# Altium project STAMPA KONACNO.PrjPcb
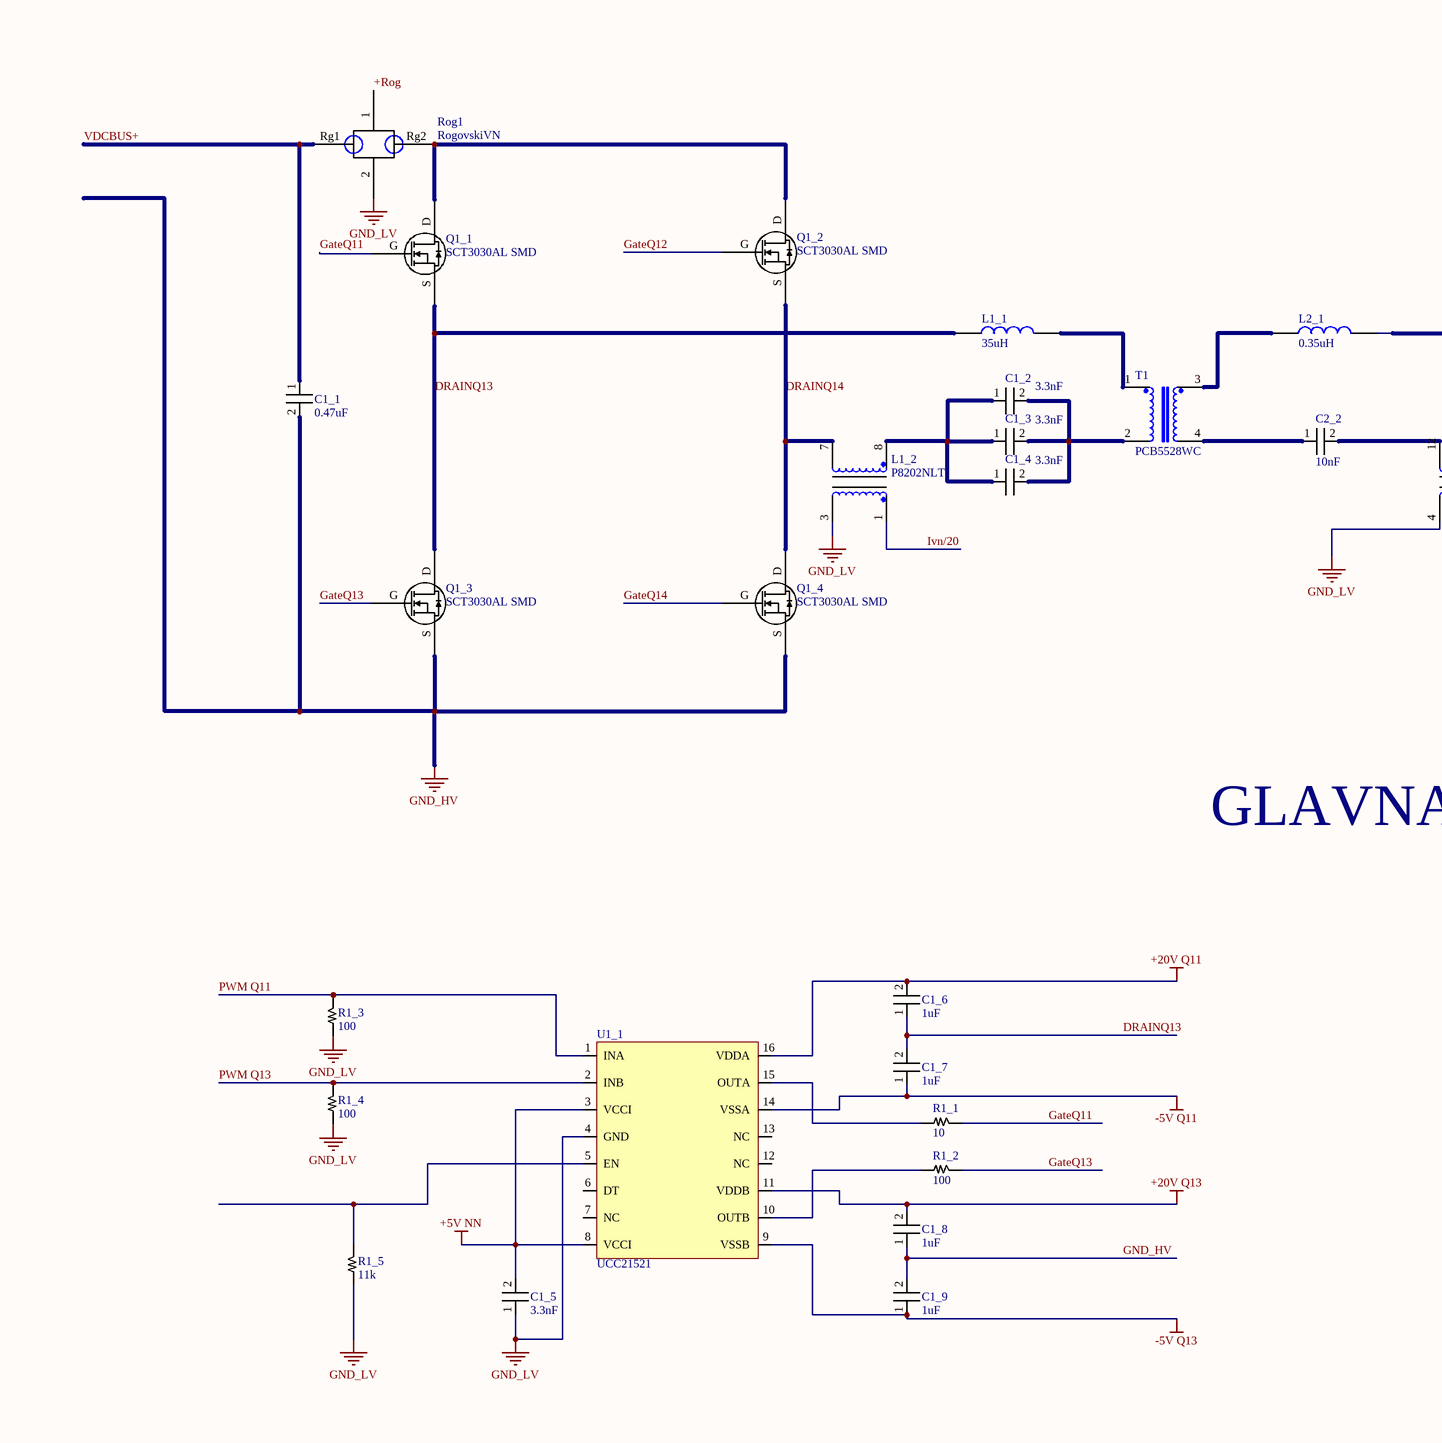
[diagram p0: SEMA KONACNO.SchDoc, row 1 of 4 left]
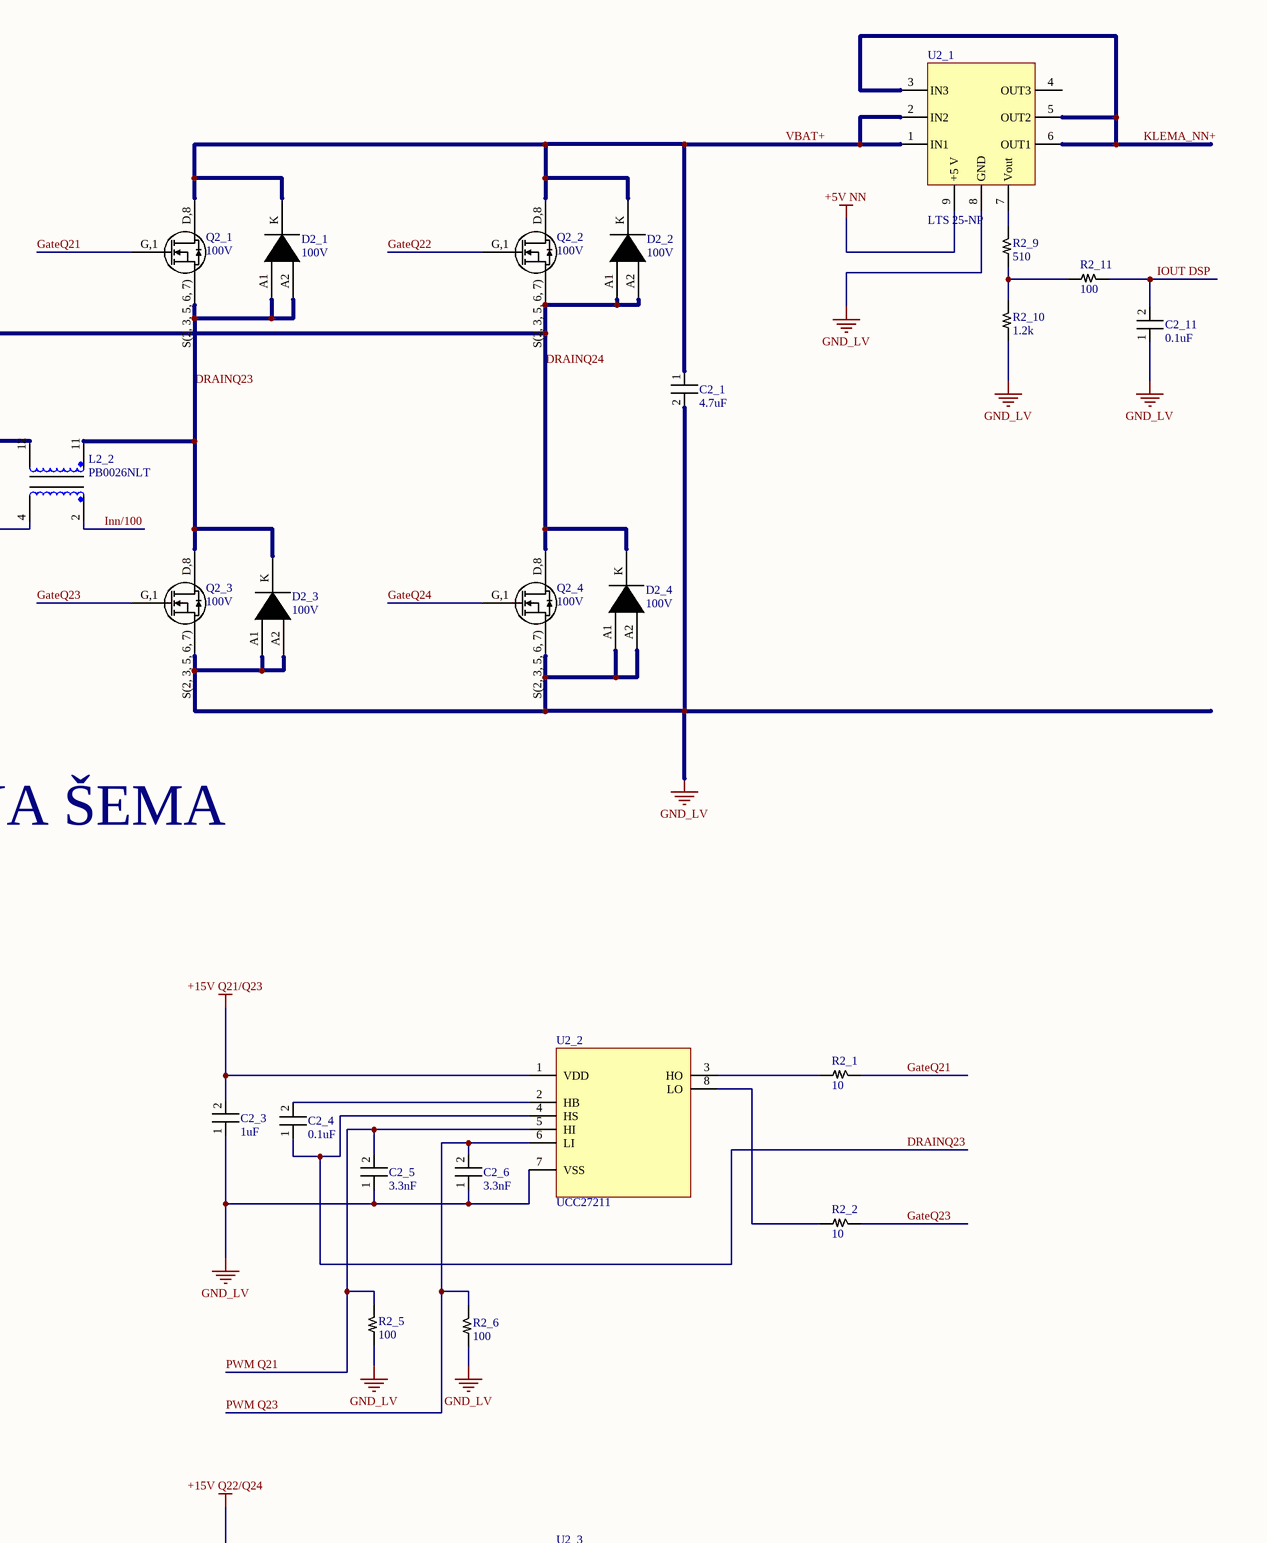
[diagram p1: SEMA KONACNO.SchDoc, row 1 of 4 right]
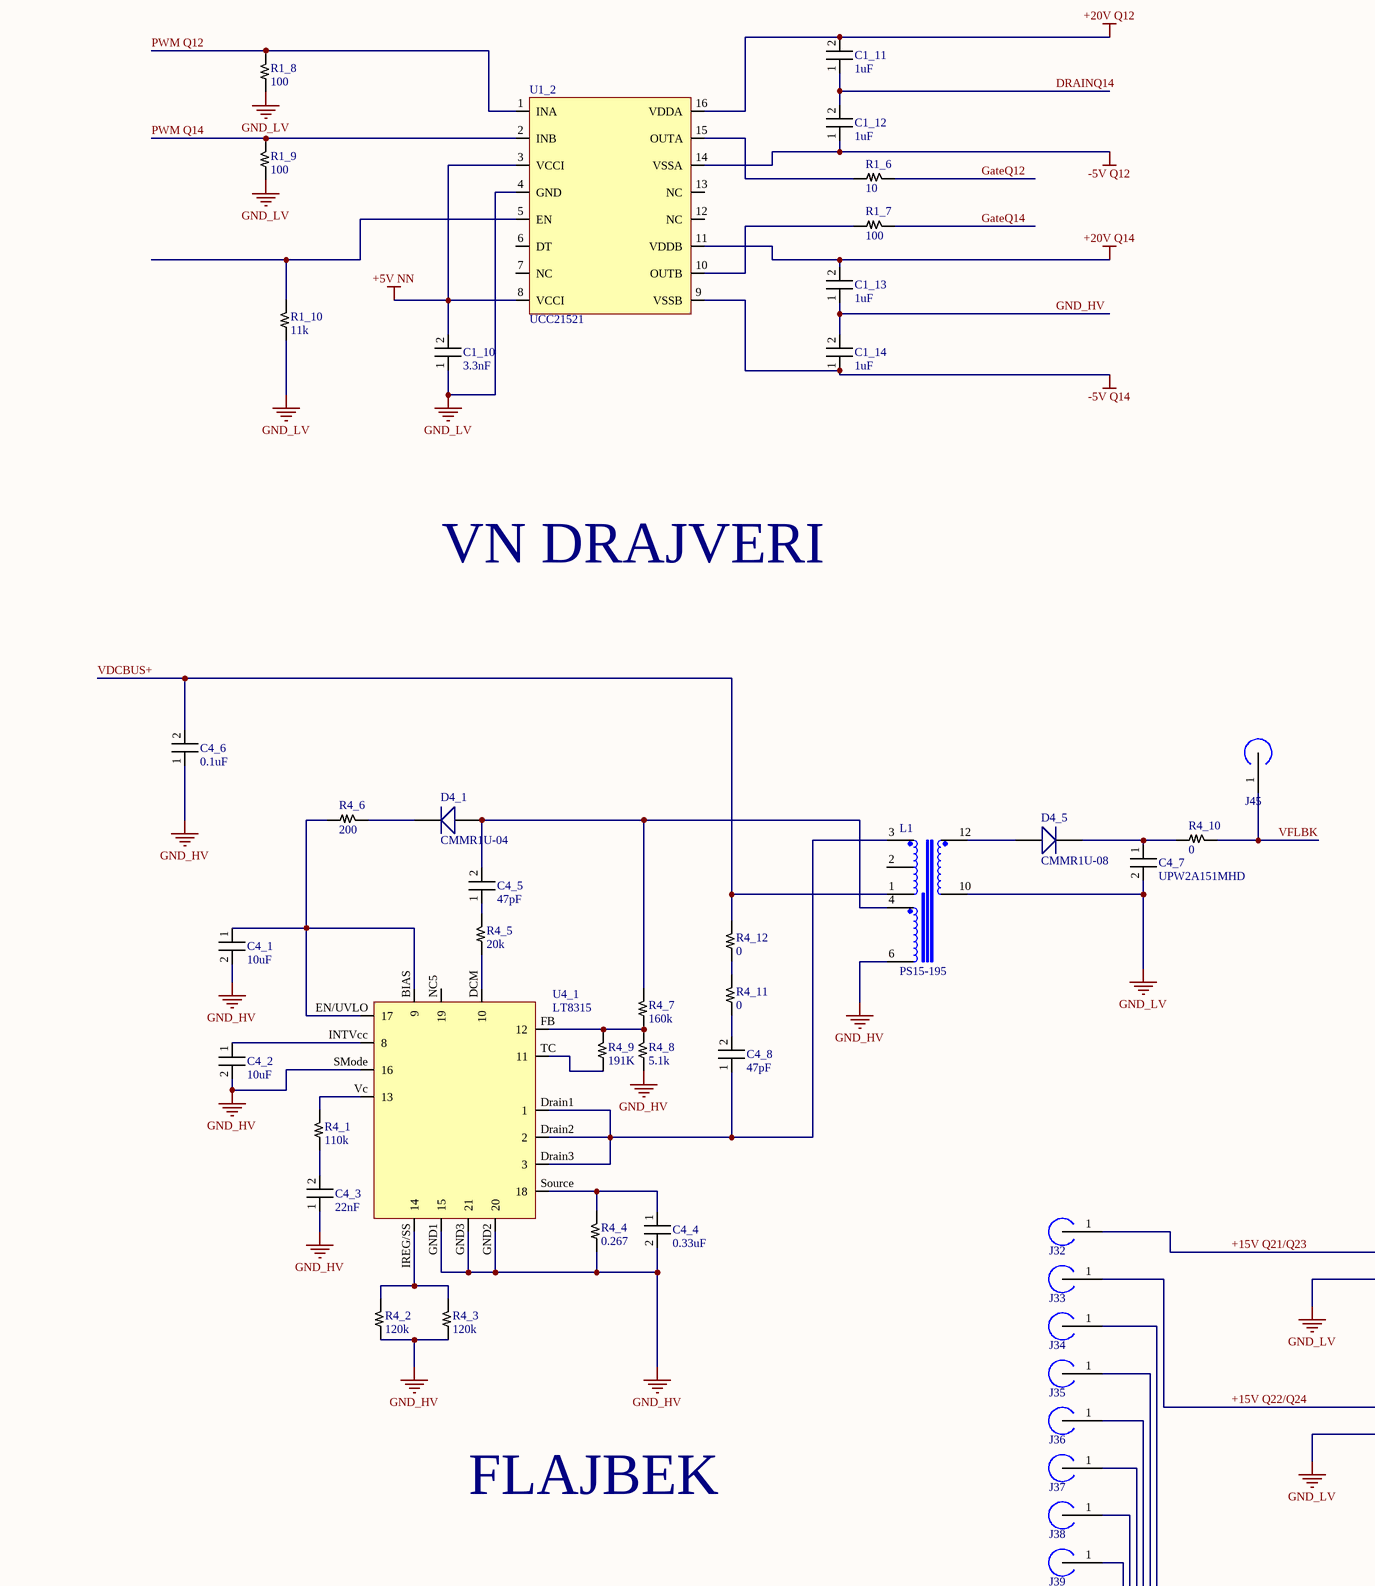
[diagram p2: SEMA KONACNO.SchDoc, row 2 of 4 left]
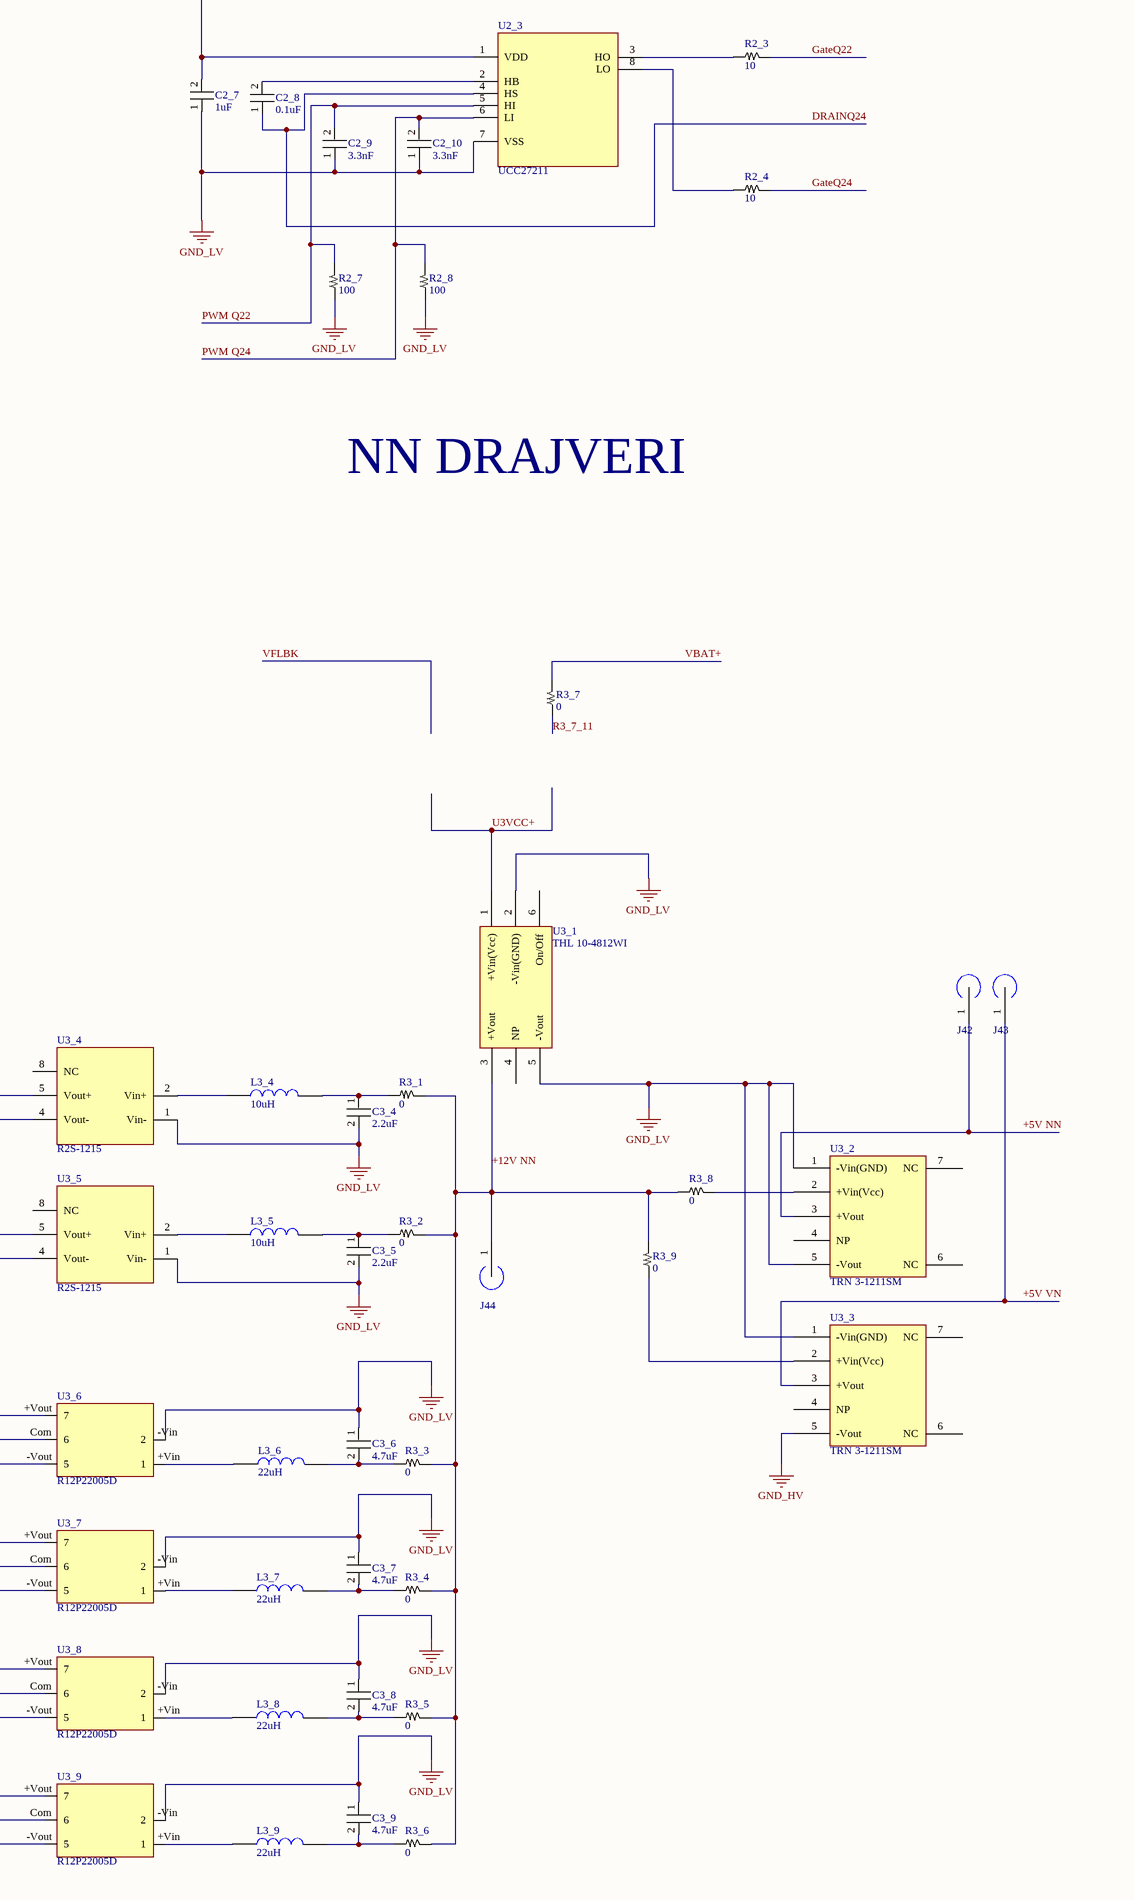
[diagram p3: SEMA KONACNO.SchDoc, row 2 of 4 right]
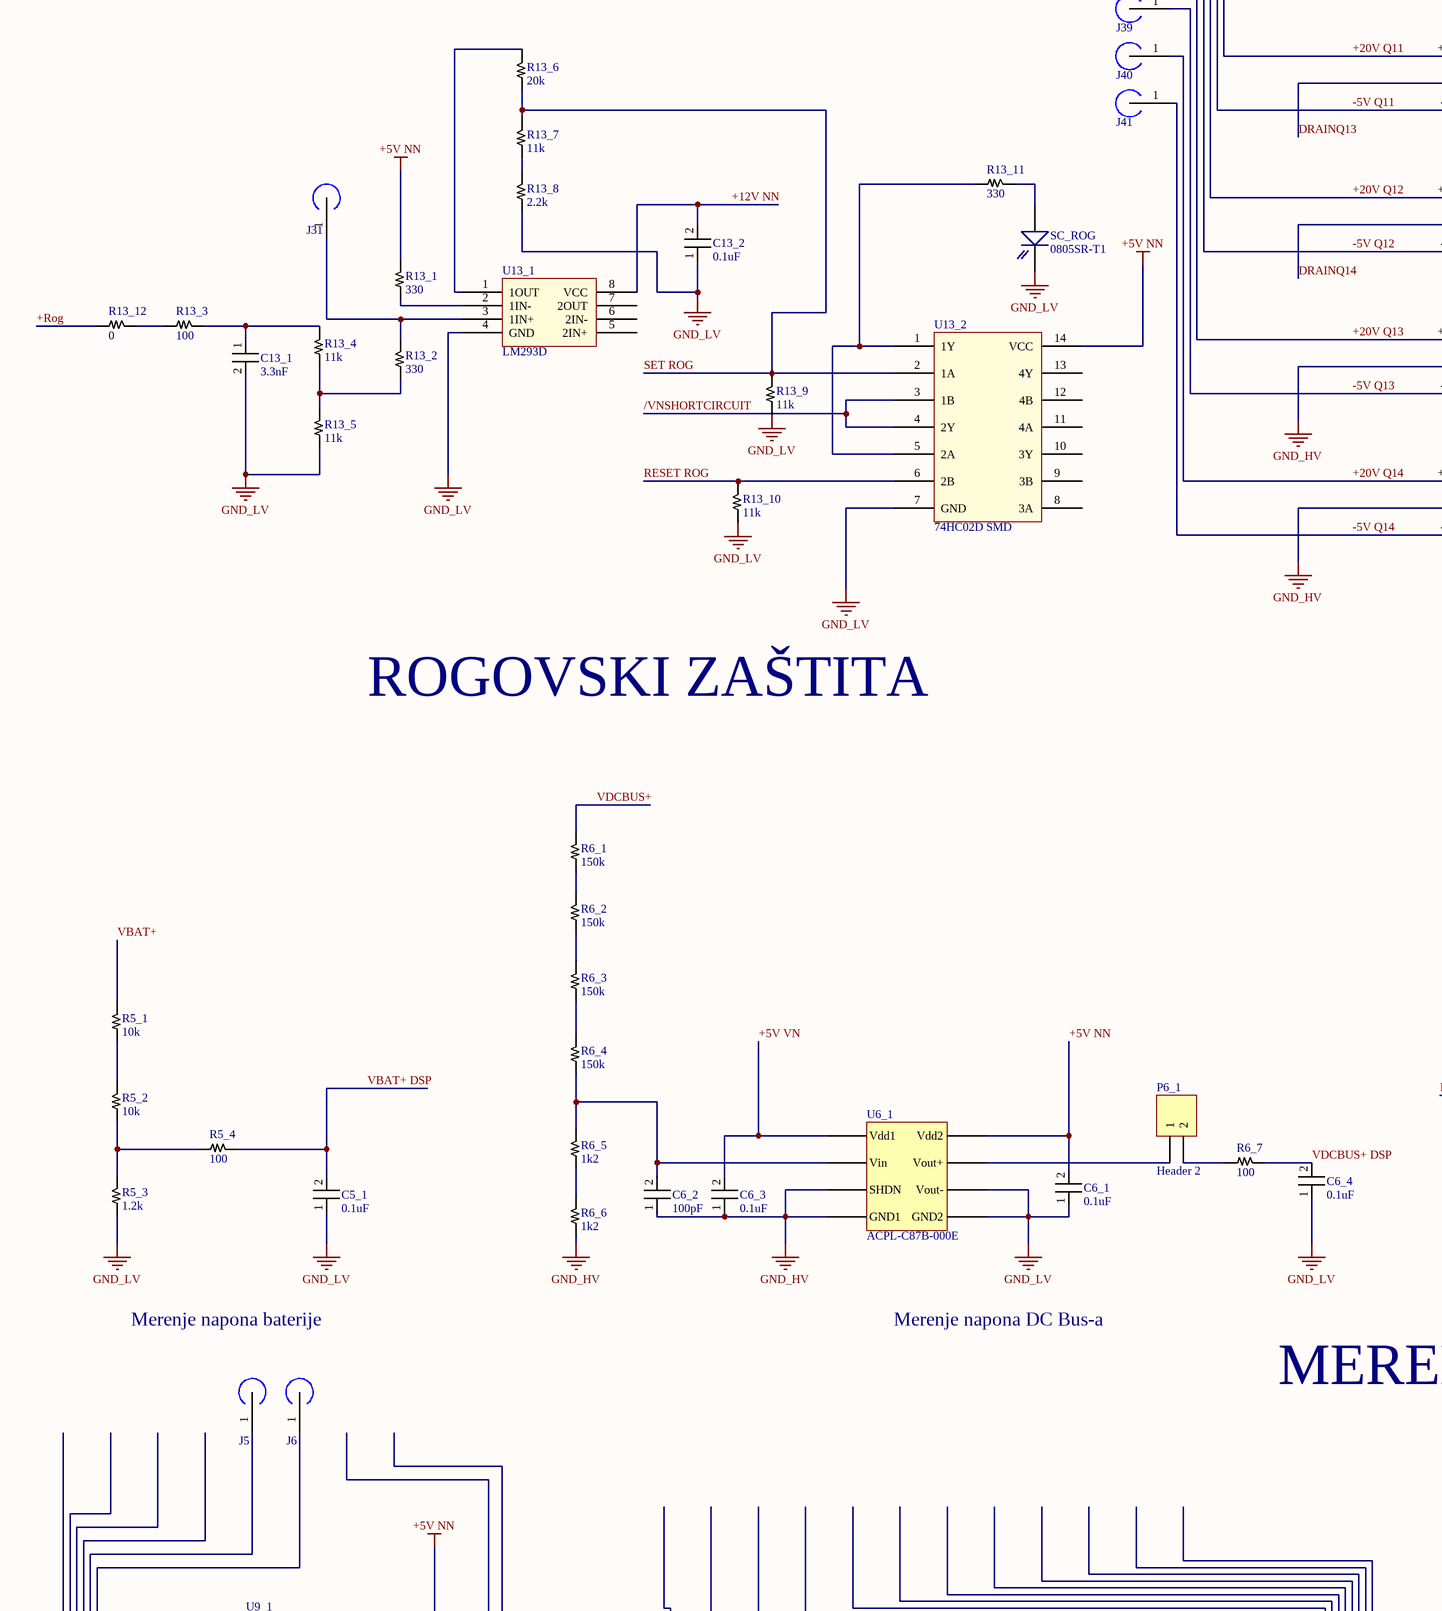
[diagram p4: SEMA KONACNO.SchDoc, row 3 of 4 left]
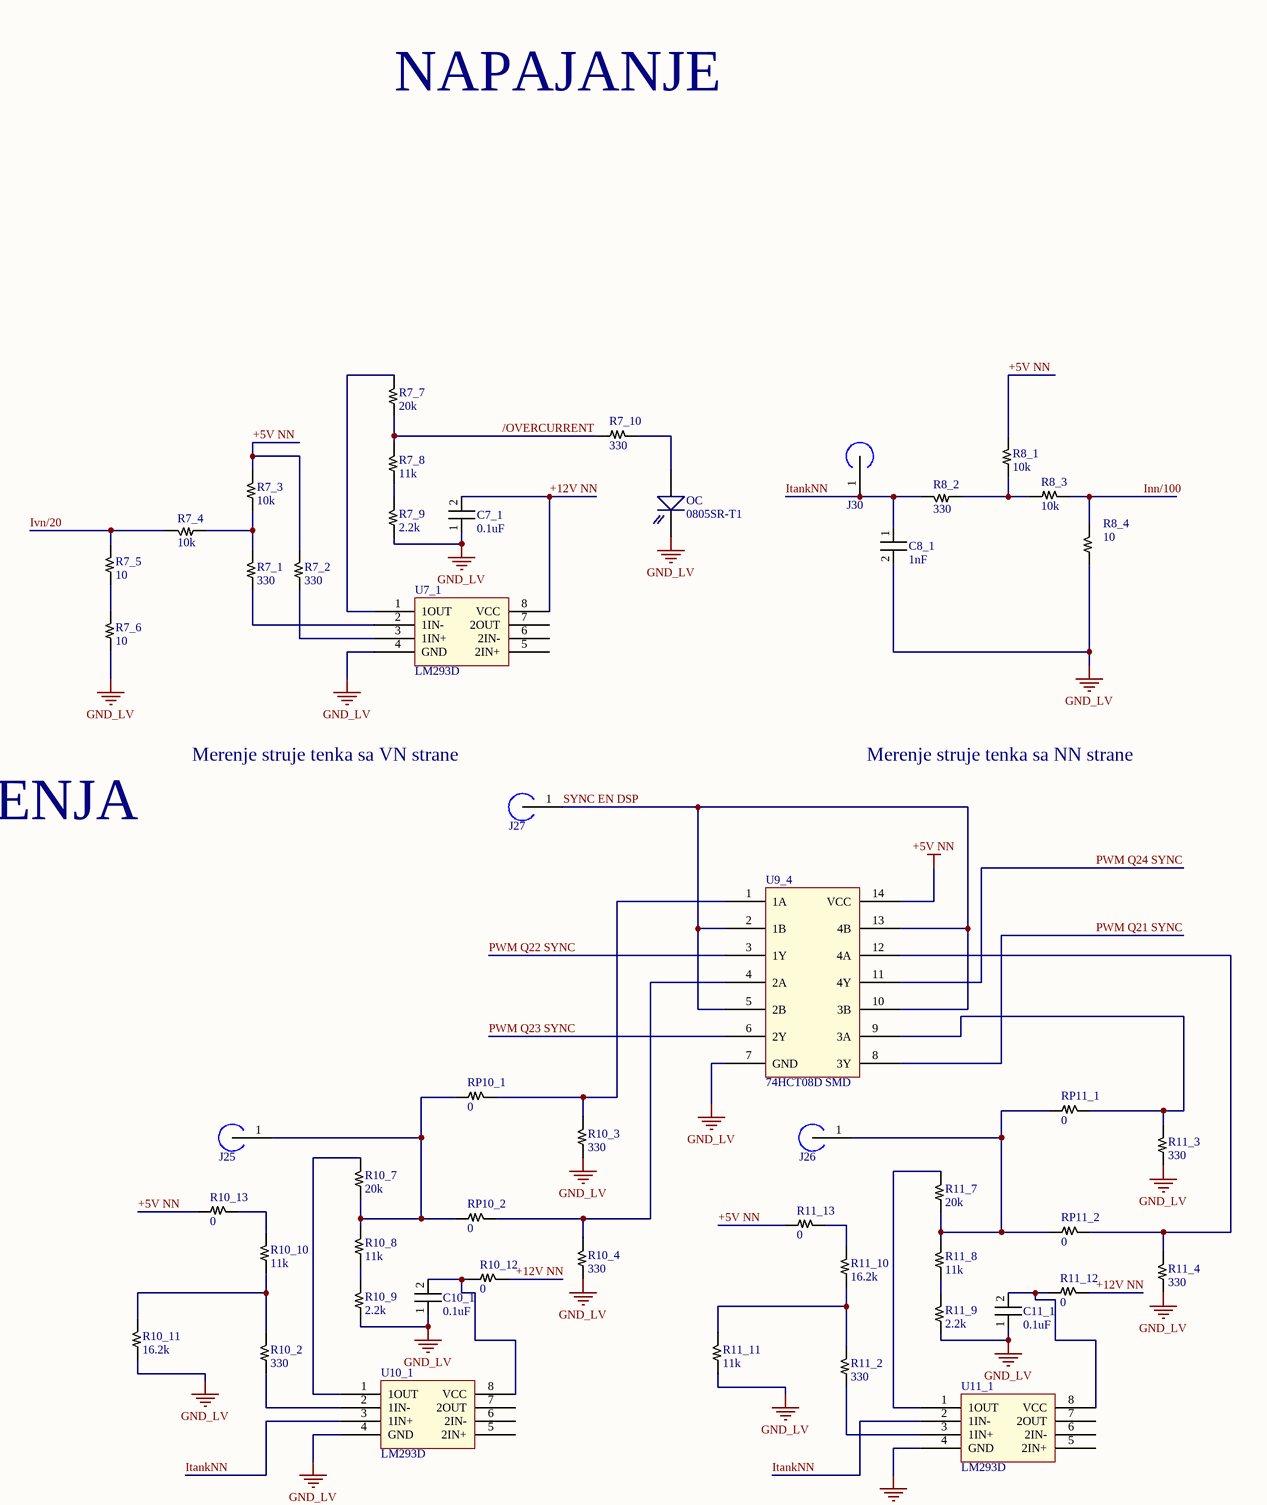
[diagram p5: SEMA KONACNO.SchDoc, row 3 of 4 right]
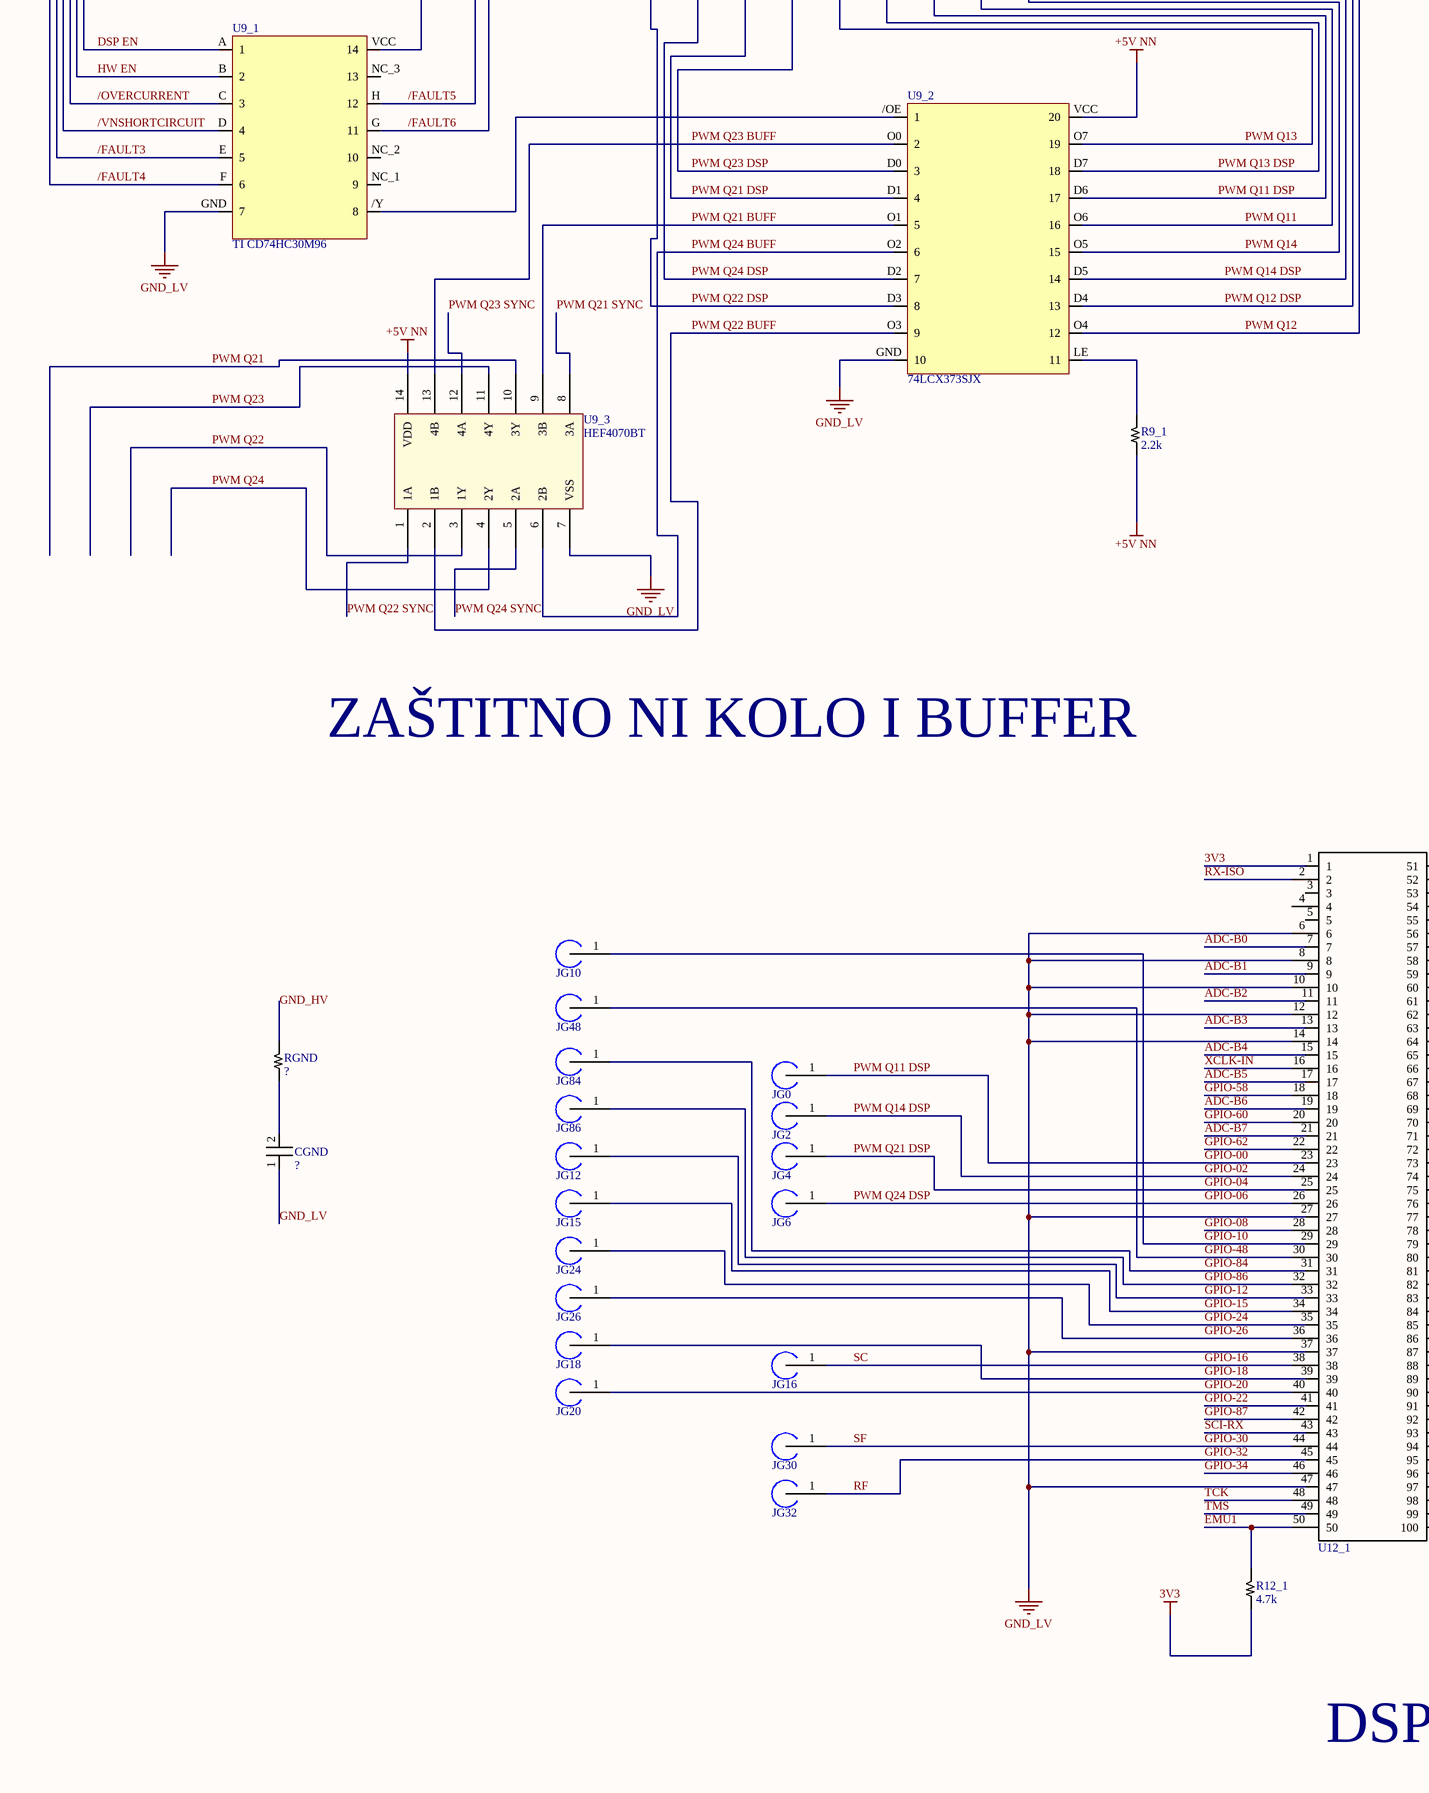
[diagram p6: SEMA KONACNO.SchDoc, row 4 of 4 left]
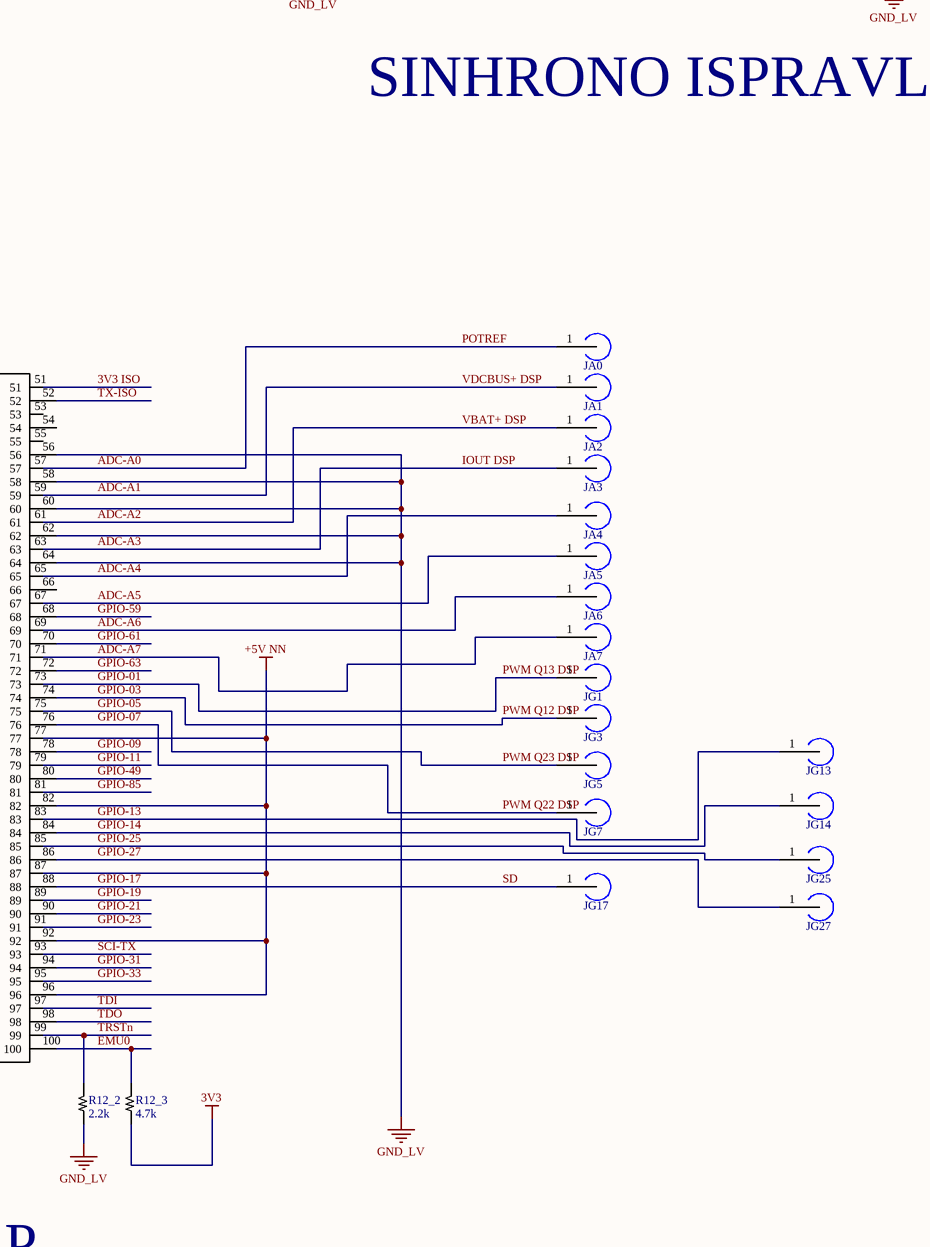
[diagram p7: SEMA KONACNO.SchDoc, row 4 of 4 right]
1 sheet, 270 parts. Net scope: global (net labels, ports and power ports of the same name join across sheets).
Board file: PCB KONACNO.PcbDoc

## Sheet SEMA KONACNO.SchDoc
size 508 x 1270 mm

### Parts
C1_1  0.47uF  [B32673P]
C1_2  3.3nF  [B32652]
C1_3  3.3nF  [B32652]
C1_4  3.3nF  [B32652]
C1_5  3.3nF  [C0805]
C1_6  1uF  [C0805]
C1_7  1uF  [C0805]
C1_8  1uF  [C0805]
C1_9  1uF  [C0805]
C1_10  3.3nF  [C0805]
C1_11  1uF  [C0805]
C1_12  1uF  [C0805]
C1_13  1uF  [C0805]
C1_14  1uF  [C0805]
C2_1  4.7uF  [B32523]
C2_2  10nF  [AVX  1A 105K AN 360]
C2_3  1uF  [C0805]
C2_4  0.1uF  [C0805]
C2_5  3.3nF  [C0805]
C2_6  3.3nF  [C0805]
C2_7  1uF  [C0805]
C2_8  0.1uF  [C0805]
C2_9  3.3nF  [C0805]
C2_10  3.3nF  [C0805]
C2_11  0.1uF  [C0805]
C3_4  2.2uF  [C1206]
C3_5  2.2uF  [C1206]
C3_6  4.7uF  [C1206]
C3_7  4.7uF  [C1206]
C3_8  4.7uF  [C1206]
C3_9  4.7uF  [C1206]
C4_1  10uF  [C1206]
C4_2  10uF  [C1206]
C4_3  22nF  [C0805]
C4_4  0.33uF  [C1206]
C4_5  47pF  [C0805]
C4_6  0.1uF  [C1210]
C4_7  UPW2A151MHD  [UPW2A151MHD]
C4_8  47pF  [C0805]
C5_1  0.1uF  [C0805]
C6_1  0.1uF  [C0805]
C6_2  100pF  [C0805]
C6_3  0.1uF  [C0805]
C6_4  0.1uF  [C0805]
C7_1  0.1uF  [C0805]
C8_1  1nF  [C0805]
C10_1  0.1uF  [C0805]
C11_1  0.1uF  [C0805]
C13_1  3.3nF  [C0805]
C13_2  0.1uF  [C0805]
CGND  ?  [C0805]
D2_1  100V  [TO-247AC]
D2_2  100V  [TO-247AC]
D2_3  100V  [TO-247AC]
D2_4  100V  [TO-247AC]
D4_1  CMMR1U-04  [SOD-123F Central S]
D4_5  CMMR1U-08  [SOD-123F Central S]
J5  Male single header  [Male_single_pin]  (value not drawn)
J6  Male single header  [Male_single_pin]  (value not drawn)
J25  Male single header  [Male_single_pin]  (value not drawn)
J26  Male single header  [Male_single_pin]  (value not drawn)
J27  Male single header  [Male_single_pin]  (value not drawn)
J30  Male single header  [Male_single_pin]  (value not drawn)
J31  Male single header  [Male_single_pin]  (value not drawn)
J32  Male single header  [Male_single_pin]  (value not drawn)
J33  Male single header  [Male_single_pin]  (value not drawn)
J34  Male single header  [Male_single_pin]  (value not drawn)
J35  Male single header  [Male_single_pin]  (value not drawn)
J36  Male single header  [Male_single_pin]  (value not drawn)
J37  Male single header  [Male_single_pin]  (value not drawn)
J38  Male single header  [Male_single_pin]  (value not drawn)
J39  Male single header  [Male_single_pin]  (value not drawn)
J40  Male single header  [Male_single_pin]  (value not drawn)
J41  Male single header  [Male_single_pin]  (value not drawn)
J42  Male single header  [Male_single_pin]  (value not drawn)
J43  Male single header  [Male_single_pin]  (value not drawn)
J44  Male single header  [Male_single_pin]  (value not drawn)
J45  Male single header  [Male_single_pin]  (value not drawn)
JA0  Male single header  [Male_single_pin]  (value not drawn)
JA1  Male single header  [Male_single_pin]  (value not drawn)
JA2  Male single header  [Male_single_pin]  (value not drawn)
JA3  Male single header  [Male_single_pin]  (value not drawn)
JA4  Male single header  [Male_single_pin]  (value not drawn)
JA5  Male single header  [Male_single_pin]  (value not drawn)
JA6  Male single header  [Male_single_pin]  (value not drawn)
JA7  Male single header  [Male_single_pin]  (value not drawn)
JG0  Male single header  [Male_single_pin]  (value not drawn)
JG1  Male single header  [Male_single_pin]  (value not drawn)
JG2  Male single header  [Male_single_pin]  (value not drawn)
JG3  Male single header  [Male_single_pin]  (value not drawn)
JG4  Male single header  [Male_single_pin]  (value not drawn)
JG5  Male single header  [Male_single_pin]  (value not drawn)
JG6  Male single header  [Male_single_pin]  (value not drawn)
JG7  Male single header  [Male_single_pin]  (value not drawn)
JG10  Male single header  [Male_single_pin]  (value not drawn)
JG12  Male single header  [Male_single_pin]  (value not drawn)
JG13  Male single header  [Male_single_pin]  (value not drawn)
JG14  Male single header  [Male_single_pin]  (value not drawn)
JG15  Male single header  [Male_single_pin]  (value not drawn)
JG16  Male single header  [Male_single_pin]  (value not drawn)
JG17  Male single header  [Male_single_pin]  (value not drawn)
JG18  Male single header  [Male_single_pin]  (value not drawn)
JG20  Male single header  [Male_single_pin]  (value not drawn)
JG24  Male single header  [Male_single_pin]  (value not drawn)
JG25  Male single header  [Male_single_pin]  (value not drawn)
JG26  Male single header  [Male_single_pin]  (value not drawn)
JG27  Male single header  [Male_single_pin]  (value not drawn)
JG30  Male single header  [Male_single_pin]  (value not drawn)
JG32  Male single header  [Male_single_pin]  (value not drawn)
JG48  Male single header  [Male_single_pin]  (value not drawn)
JG84  Male single header  [Male_single_pin]  (value not drawn)
JG86  Male single header  [Male_single_pin]  (value not drawn)
L1  PS15-195  [PS15-195]
L1_1  35uH  [PCB3515M1]
L1_2  P8202NLT  [P8202NLT]
L2_1  0.35uH  [PCB3515M1]
L2_2  PB0026NLT  [PB0026NLT]
L3_4  10uH  [SDE0403A-100M]
L3_5  10uH  [SDE0403A-100M]
L3_6  22uH  [Ind_RLB0914-470KL]
L3_7  22uH  [Ind_RLB0914-470KL]
L3_8  22uH  [Ind_RLB0914-470KL]
L3_9  22uH  [Ind_RLB0914-470KL]
OC  0805SR-T1  [0805]
P6_1  Header 2  [HDR1X2]
Q1_1  SCT3030AL SMD  [TO-247AD-V SMD]
Q1_2  SCT3030AL SMD  [TO-247AD-V SMD]
Q1_3  SCT3030AL SMD  [TO-247AD-V SMD]
Q1_4  SCT3030AL SMD  [TO-247AD-V SMD]
Q2_1  100V  [D2-PAK 7 PIN]
Q2_2  100V  [D2-PAK 7 PIN]
Q2_3  100V  [D2-PAK 7 PIN]
Q2_4  100V  [D2-PAK 7 PIN]
R1_1  10  [R0805]
R1_2  100  [R0805]
R1_3  100  [R0805]
R1_4  100  [R0805]
R1_5  11k  [R0805]
R1_6  10  [R0805]
R1_7  100  [R0805]
R1_8  100  [R0805]
R1_9  100  [R0805]
R1_10  11k  [R0805]
R2_1  10  [R0805]
R2_2  10  [R0805]
R2_3  10  [R0805]
R2_4  10  [R0805]
R2_5  100  [R0805]
R2_6  100  [R0805]
R2_7  100  [R0805]
R2_8  100  [R0805]
R2_9  510  [R0805]
R2_10  1.2k  [R0805]
R2_11  100  [R0805]
R3_1  0  [R0805]
R3_2  0  [R0805]
R3_3  0  [R0805]
R3_4  0  [R0805]
R3_5  0  [R0805]
R3_6  0  [R0805]
R3_7  0  [R0805]
R3_8  0  [R0805]
R3_9  0  [R0805]
R4_1  110k  [R0805]
R4_2  120k  [R0805]
R4_3  120k  [R0805]
R4_4  0.267  [R0805]
R4_5  20k  [R0805]
R4_6  200  [R0805]
R4_7  160k  [R0805]
R4_8  5.1k  [R0805]
R4_9  191K  [R0805]
R4_10  0  [R0805]
R4_11  0  [R0805]
R4_12  0  [R0805]
R5_1  10k  [R0805]
R5_2  10k  [R0805]
R5_3  1.2k  [R0805]
R5_4  100  [R0805]
R6_1  150k  [R0603]
R6_2  150k  [R0603]
R6_3  150k  [R0603]
R6_4  150k  [R0603]
R6_5  1k2  [R0805]
R6_6  1k2  [R0805]
R6_7  100  [R0805]
R7_1  330  [R0805]
R7_2  330  [R0805]
R7_3  10k  [R0805]
R7_4  10k  [R0805]
R7_5  10  [R0805]
R7_6  10  [R0805]
R7_7  20k  [R0805]
R7_8  11k  [R0805]
R7_9  2.2k  [R0805]
R7_10  330  [R0805]
R8_1  10k  [R0805]
R8_2  330  [R0805]
R8_3  10k  [R0805]
R8_4  10  [R0805]
R9_1  2.2k  [R0805]
R10_2  330  [R0805]
R10_3  330  [R0805]
R10_4  330  [R0805]
R10_7  20k  [R0805]
R10_8  11k  [R0805]
R10_9  2.2k  [R0805]
R10_10  11k  [R0805]
R10_11  16.2k  [R0805]
R10_12  0  [R0805]
R10_13  0  [R0805]
R11_2  330  [R0805]
R11_3  330  [R0805]
R11_4  330  [R0805]
R11_7  20k  [R0805]
R11_8  11k  [R0805]
R11_9  2.2k  [R0805]
R11_10  16.2k  [R0805]
R11_11  11k  [R0805]
R11_12  0  [R0805]
R11_13  0  [R0805]
R12_1  4.7k  [R0805]
R12_2  2.2k  [R0805]
R12_3  4.7k  [R0805]
R13_1  330  [R0805]
R13_2  330  [R0805]
R13_3  100  [R0805]
R13_4  11k  [R0805]
R13_5  11k  [R0805]
R13_6  20k  [R0805]
R13_7  11k  [R0805]
R13_8  2.2k  [R0805]
R13_9  11k  [R0805]
R13_10  11k  [R0805]
R13_11  330  [R0805]
R13_12  0  [R0805]
RGND  ?  [R0805]
Rog1  RogovskiVN  [RogovskiVNpravi]
RP10_1  0  [R0805]
RP10_2  0  [R0805]
RP11_1  0  [R0805]
RP11_2  0  [R0805]
SC_ROG  0805SR-T1  [0805]
T1  PCB5528WC  [PCB5528WC]
U1_1  UCC21521  [SOIC RW-16]
U1_2  UCC21521  [SOIC RW-16]
U2_1  LTS 25-NP  [LEM LTS 25-NP]
U2_2  UCC27211  [UCC27211AQDDARQ1]
U2_3  UCC27211  [UCC27211AQDDARQ1]
U3_1  THL 10-4812WI  [THL 10WI]
U3_2  TRN 3-1211SM  [TRN 3SM]
U3_3  TRN 3-1211SM  [TRN 3SM]
U3_4  R2S-1215  [R2S-1215]
U3_5  R2S-1215  [R2S-1215]
U3_6  R12P22005D  [R12P22005D]
U3_7  R12P22005D  [R12P22005D]
U3_8  R12P22005D  [R12P22005D]
U3_9  R12P22005D  [R12P22005D]
U4_1  LT8315  [LT8315]
U6_1  ACPL-C87B-000E  [ACPL-C87B-000E]
U7_1  LM293D  [SO8]
U9_1  TI CD74HC30M96  [CD74]
U9_2  74LCX373SJX  [74LCX]
U9_3  HEF4070BT  [SO14]
U9_4  74HCT08D SMD  [SO14]
U10_1  LM293D  [SO8]
U11_1  LM293D  [SO8]
U12_1  DSP 28335  [DSP 28335]  (value not drawn)
U13_1  LM293D  [SO8]
U13_2  74HC02D SMD  [SO14]

### Nets
3V3: R12_1.1 R12_3.1 U12_1.1
+5V NN: C1_5.2 C1_10.2 C6_1.2 J42.1 R7_2.2 R7_3.2 R8_1.2 R9_1.1 R10_13.1 R11_13.1 R13_1.2 U1_1.3(VCCI) U1_1.8(VCCI) U1_2.3(VCCI) U1_2.8(VCCI) U2_1.9(+5_V) U3_2.3(+Vout) U6_1.8(Vdd2) U9_1.VCC(14) U9_2.VCC(20) U9_3.14(VDD) U9_4.14(VCC) U12_1.77 U12_1.82 U12_1.87 U12_1.92 U12_1.96 U13_2.14(VCC)
+15V Q21/Q23: C2_3.2 J32.1 U2_2.1(VDD) U3_4.5(Vout+)
+15V Q22/Q24: C2_7.2 J33.1 U2_3.1(VDD) U3_5.5(Vout+)
+20V Q11: C1_6.2 J34.1 U1_1.16(VDDA) U3_6.+Vout(7)
+20V Q12: C1_11.2 J36.1 U1_2.16(VDDA) U3_7.+Vout(7)
+20V Q13: C1_8.2 J38.1 U1_1.11(VDDB) U3_8.+Vout(7)
+20V Q14: C1_13.2 J40.1 U1_2.11(VDDB) U3_9.+Vout(7)
-5V Q11: C1_7.1 J35.1 U1_1.14(VSSA) U3_6.-Vout(5)
-5V Q12: C1_12.1 J37.1 U1_2.14(VSSA) U3_7.-Vout(5)
-5V Q13: C1_9.1 J39.1 U1_1.9(VSSB) U3_8.-Vout(5)
-5V Q14: C1_14.1 J41.1 U1_2.9(VSSB) U3_9.-Vout(5)
GND_HV: C1_1.2 C1_8.1 C1_9.2 C1_13.1 C1_14.2 C4_1.2 C4_2.2 C4_3.1 C4_4.2 C4_6.1 C6_2.1 C6_3.1 L1.6 Q1_3.S(Source) Q1_4.S(Source) R4_2.1 R4_3.1 R4_4.1 R4_8.1 R6_6.1 RGND.2 U3_3.5(-Vout) U3_8.Com(6) U3_9.Com(6) U4_1.GND1(15) U4_1.GND2(20) U4_1.GND3(21) U4_1.SMode(16) U6_1.3(SHDN) U6_1.4(GND1)
GND_LV: C1_5.1 C1_10.1 C2_1.2 C2_3.1 C2_5.1 C2_6.1 C2_7.1 C2_9.1 C2_10.1 C2_11.1 C3_4.2 C3_5.2 C3_6.1 C3_7.1 C3_8.1 C3_9.1 C4_7.2 C5_1.1 C6_1.1 C6_4.1 C7_1.1 C8_1.2 C10_1.1 C11_1.1 C13_1.2 C13_2.1 CGND.1 D2_3.A1(Anode_1) D2_3.A2(Anode_2) D2_4.A1(Anode_1) D2_4.A2(Anode_2) L1.10 L1_2.3 L2_2.4 OC.1 Q2_3.S(2,_3,_5,_6,_7)(Source) Q2_4.S(2,_3,_5,_6,_7)(Source) R1_3.1 R1_4.1 R1_5.1 R1_8.1 R1_9.1 R1_10.1 R2_5.1 R2_6.1 R2_7.1 R2_8.1 R2_10.1 R5_3.1 R7_6.1 R7_9.1 R8_4.1 R10_3.1 R10_4.1 R10_9.1 R10_11.1 R11_3.1 R11_4.1 R11_9.1 R11_11.1 R12_2.1 R13_5.1 R13_8.1 R13_9.1 R13_10.1 Rog1.2 SC_ROG.1 U1_1.4(GND) U1_2.4(GND) U2_1.8(GND) U2_2.7(VSS) U2_3.7(VSS) U3_1.2(-Vin(GND)) U3_1.5(-Vout) U3_2.1(-Vin(GND)) U3_2.5(-Vout) U3_3.1(-Vin(GND)) U3_4.1(Vin-) U3_4.4(Vout-) U3_5.1(Vin-) U3_5.4(Vout-) U3_6.-Vin(2) U3_7.-Vin(2) U3_8.-Vin(2) U3_9.-Vin(2) U6_1.5(GND2) U6_1.6(Vout-) U7_1.4(GND) U9_1.GND(7) U9_2.GND(10) U9_3.7(VSS) U9_4.7(GND) U10_1.4(GND) U11_1.4(GND) U12_1.6 U12_1.8 U12_1.10 U12_1.12 U12_1.14 U12_1.27 U12_1.37 U12_1.47 U12_1.56 U12_1.58 U12_1.60 U12_1.62 U12_1.64 U13_1.4(GND) U13_2.7(GND)
3V3 ISO: U12_1.51
+5V VN: C6_3.2 J43.1 U3_3.3(+Vout) U6_1.1(Vdd1)
+12V NN: C7_1.2 C13_2.2 J44.1 R3_1.2 R3_2.2 R3_3.2 R3_4.2 R3_5.2 R3_6.2 R3_8.1 R3_9.2 R10_12.2 R11_12.2 U3_1.3(+Vout) U7_1.8(VCC) U13_1.8(VCC)
+Rog: R13_12.1 Rog1.1
/FAULT3: U9_1.E(5)
/FAULT4: U9_1.F(6)
/FAULT5: U9_1.H(12)
/FAULT6: U9_1.G(11)
/OVERCURRENT: R7_7.1 R7_8.2 R7_10.1 U9_1.C(3)
/VNSHORTCIRCUIT: U9_1.D(4) U13_2.3(1B) U13_2.4(2Y)
ADC-A0: JA0.1 U12_1.57  [also labelled POTREF]
ADC-A1: C6_4.2 JA1.1 R6_7.2 U12_1.59  [also labelled VDCBUS+ DSP]
ADC-A2: C5_1.2 JA2.1 R5_4.2 U12_1.61  [also labelled VBAT+ DSP]
ADC-A3: C2_11.2 JA3.1 R2_11.2 U12_1.63  [also labelled IOUT DSP]
ADC-A4: JA4.1 U12_1.65
ADC-A5: JA5.1 U12_1.67
ADC-A6: JA6.1 U12_1.69
ADC-A7: JA7.1 U12_1.71
ADC-B0: U12_1.7
ADC-B1: U12_1.9
ADC-B2: U12_1.11
ADC-B3: U12_1.13
ADC-B4: U12_1.15
ADC-B5: U12_1.17
ADC-B6: U12_1.19
ADC-B7: U12_1.21
DRAINQ13: C1_6.1 C1_7.2 L1_1.1 Q1_1.S(Source) Q1_3.D(Drain) U3_6.Com(6)
DRAINQ14: C1_11.1 C1_12.2 L1_2.7 Q1_2.S(Source) Q1_4.D(Drain) U3_7.Com(6)
DRAINQ23: C2_4.1 D2_1.A1(Anode_1) D2_1.A2(Anode_2) D2_3.K(Kathode) L2_2.11 Q2_1.S(2,_3,_5,_6,_7)(Source) Q2_3.D,8(Drain) U2_2.4(HS)
DRAINQ24: C2_8.1 D2_2.A1(Anode_1) D2_2.A2(Anode_2) D2_4.K(Kathode) L2_1.2 Q2_2.S(2,_3,_5,_6,_7)(Source) Q2_4.D,8(Drain) U2_3.4(HS)
DSP EN: J6.1 U9_1.A(1)
EMU0: R12_3.2 U12_1.100
EMU1: R12_1.2 U12_1.50
GateQ11: Q1_1.G(Gate) R1_1.2
GateQ12: Q1_2.G(Gate) R1_6.2
GateQ13: Q1_3.G(Gate) R1_2.2
GateQ14: Q1_4.G(Gate) R1_7.2
GateQ21: Q2_1.G,1(Gate) R2_1.2
GateQ22: Q2_2.G,1(Gate) R2_3.2
GateQ23: Q2_3.G,1(Gate) R2_2.2
GateQ24: Q2_4.G,1(Gate) R2_4.2
GPIO-00: JG0.1 U9_2.D6(17) U12_1.23  [also labelled PWM Q11 DSP]
GPIO-01: JG1.1 U9_2.D7(18) U12_1.73  [also labelled PWM Q13 DSP]
GPIO-02: JG2.1 U9_2.D5(14) U12_1.24  [also labelled PWM Q14 DSP]
GPIO-03: JG3.1 U9_2.D4(13) U12_1.74  [also labelled PWM Q12 DSP]
GPIO-04: JG4.1 U9_2.D1(4) U12_1.25  [also labelled PWM Q21 DSP]
GPIO-05: JG5.1 U9_2.D0(3) U12_1.75  [also labelled PWM Q23 DSP]
GPIO-06: JG6.1 U9_2.D2(7) U12_1.26  [also labelled PWM Q24 DSP]
GPIO-07: JG7.1 U9_2.D3(8) U12_1.76  [also labelled PWM Q22 DSP]
GPIO-08: U12_1.28
GPIO-09: U12_1.78
GPIO-10: JG10.1 U12_1.29
GPIO-11: U12_1.79
GPIO-12: JG12.1 U12_1.33
GPIO-13: JG13.1 U12_1.83
GPIO-14: JG14.1 U12_1.84
GPIO-15: JG15.1 U12_1.34
GPIO-16: JG16.1 U12_1.38  [also labelled SC]
GPIO-17: JG17.1 U12_1.88  [also labelled SD]
GPIO-18: JG18.1 U12_1.39
GPIO-19: U12_1.89
GPIO-20: JG20.1 U12_1.40
GPIO-21: U12_1.90
GPIO-22: U12_1.41
GPIO-23: U12_1.91
GPIO-24: JG24.1 U12_1.35
GPIO-25: JG25.1 U12_1.85
GPIO-26: JG26.1 U12_1.36
GPIO-27: JG27.1 U12_1.86
GPIO-30: JG30.1 U12_1.44  [also labelled SF]
GPIO-31: U12_1.94
GPIO-32: JG32.1 U12_1.45  [also labelled RF]
GPIO-33: U12_1.95
GPIO-34: U12_1.46
GPIO-48: JG48.1 U12_1.30
GPIO-49: U12_1.80
GPIO-58: U12_1.18
GPIO-59: U12_1.68
GPIO-60: U12_1.20
GPIO-61: U12_1.70
GPIO-62: U12_1.22
GPIO-63: U12_1.72
GPIO-84: JG84.1 U12_1.31
GPIO-85: U12_1.81
GPIO-86: JG86.1 U12_1.32
GPIO-87: U12_1.42
HW EN: J5.1 U9_1.B(2)
Inn/100: L2_2.2 R8_3.2 R8_4.2
ItankNN: C8_1.1 J30.1 R8_2.2 U10_1.3(1IN+) U11_1.2(1IN-)
Ivn/20: L1_2.1 R7_4.2 R7_5.2
KLEMA_NN+: U2_1.3(IN3) U2_1.5(OUT2) U2_1.6(OUT1)
PWM Q11: R1_3.2 U1_1.1(INA) U9_2.O6(16)
PWM Q12: R1_8.2 U1_2.1(INA) U9_2.O4(12)
PWM Q13: R1_4.2 U1_1.2(INB) U9_2.O7(19)
PWM Q14: R1_9.2 U1_2.2(INB) U9_2.O5(15)
PWM Q21: C2_5.2 R2_5.2 U2_2.5(HI) U9_3.10(3Y)
PWM Q21 BUFF: U9_2.O1(5) U9_3.9(3B)
PWM Q21 SYNC: U9_3.8(3A) U9_4.8(3Y)
PWM Q22: C2_9.2 R2_7.2 U2_3.5(HI) U9_3.3(1Y)
PWM Q22 BUFF: U9_2.O3(9) U9_3.2(1B)
PWM Q22 SYNC: U9_3.1(1A) U9_4.3(1Y)
PWM Q23: C2_6.2 R2_6.2 U2_2.6(LI) U9_3.11(4Y)
PWM Q23 BUFF: U9_2.O0(2) U9_3.13(4B)
PWM Q23 SYNC: U9_3.12(4A) U9_4.6(2Y)
PWM Q24: C2_10.2 R2_8.2 U2_3.6(LI) U9_3.4(2Y)
PWM Q24 BUFF: U9_2.O2(6) U9_3.6(2B)
PWM Q24 SYNC: U9_3.5(2A) U9_4.11(4Y)
R3_7_11: R3_7.1
RESET ROG: R13_10.2 U13_2.6(2B)
RX-ISO: U12_1.2
SCI-RX: U12_1.43
SCI-TX: U12_1.93
SET ROG: R13_6.1 R13_7.2 R13_9.2 U13_2.2(1A)
SYNC EN DSP: J27.1 U9_4.2(1B) U9_4.5(2B) U9_4.10(3B) U9_4.13(4B)
TCK: U12_1.48
TDI: U12_1.97
TDO: U12_1.98
TMS: U12_1.49
TRSTn: R12_2.2 U12_1.99
TX-ISO: U12_1.52
U3VCC+: U3_1.1(+Vin(Vcc))
VBAT+: C2_1.1 D2_1.K(Kathode) D2_2.K(Kathode) Q2_1.D,8(Drain) Q2_2.D,8(Drain) R3_7.2 R5_1.2 U2_1.1(IN1) U2_1.2(IN2)
VDCBUS+: C1_1.1 C4_6.2 L1.1 R4_12.2 R6_1.2 Rog1.Rg1
VFLBK: J45.1 R4_10.2
XCLK-IN: U12_1.16
NetC1_2_1: C1_2.1 C1_3.1 C1_4.1 L1_2.8
NetC1_2_2: C1_2.2 C1_3.2 C1_4.2 T1.2
NetC2_2_1: C2_2.1 T1.4
NetC2_2_2: C2_2.2 L2_2.12
NetC2_4_2: C2_4.2 U2_2.2(HB)
NetC2_8_2: C2_8.2 U2_3.2(HB)
NetC3_4_1: C3_4.1 L3_4.2 R3_1.1
NetC3_5_1: C3_5.1 L3_5.2 R3_2.1
NetC3_6_2: C3_6.2 L3_6.2 R3_3.1
NetC3_7_2: C3_7.2 L3_7.2 R3_4.1
NetC3_8_2: C3_8.2 L3_8.2 R3_5.1
NetC3_9_2: C3_9.2 L3_9.2 R3_6.1
NetC4_1_1: C4_1.1 R4_6.1 U4_1.BIAS(9) U4_1.EN/UVLO(17)
NetC4_2_1: C4_2.1 U4_1.INTVcc(8)
NetC4_3_2: C4_3.2 R4_1.1
NetC4_4_1: C4_4.1 R4_4.2 U4_1.Source(18)
NetC4_5_1: C4_5.1 R4_5.2
NetC4_5_2: C4_5.2 D4_1.2 L1.4 R4_7.2
NetC4_7_1: C4_7.1 D4_5.1 R4_10.1
NetC4_8_1: C4_8.1 L1.3 U4_1.Drain1(1) U4_1.Drain2(2) U4_1.Drain3(3)
NetC4_8_2: C4_8.2 R4_11.1
NetC6_2_2: C6_2.2 R6_4.1 R6_5.2 U6_1.2(Vin)
NetC10_1_2: C10_1.2 R10_12.1 U10_1.8(VCC)
NetC11_1_2: C11_1.2 R11_12.1 U11_1.8(VCC)
NetC13_1_1: C13_1.1 R13_3.2 R13_4.2
NetCGND_2: CGND.2 RGND.1
NetD4_1_1: D4_1.1 R4_6.2
NetD4_5_2: D4_5.2 L1.12
NetJ25_1: J25.1 R10_7.1 R10_8.2 RP10_1.1 RP10_2.1
NetJ26_1: J26.1 R11_7.1 R11_8.2 RP11_1.1 RP11_2.1
NetJ31_1: J31.1 R13_2.2 U13_1.3(1IN+)
NetL1_1_2: L1_1.2 T1.1
NetL2_1_1: L2_1.1 T1.3
NetL3_4_1: L3_4.1 U3_4.2(Vin+)
NetL3_5_1: L3_5.1 U3_5.2(Vin+)
NetL3_6_1: L3_6.1 U3_6.+Vin(1)
NetL3_7_1: L3_7.1 U3_7.+Vin(1)
NetL3_8_1: L3_8.1 U3_8.+Vin(1)
NetL3_9_1: L3_9.1 U3_9.+Vin(1)
NetOC_2: OC.2 R7_10.2
NetP6_1_1: P6_1.1 U6_1.7(Vout+)
NetP6_1_2: P6_1.2 R6_7.1
NetQ1_1_D: Q1_1.D(Drain) Q1_2.D(Drain) Rog1.Rg2
NetR1_1_1: R1_1.1 U1_1.15(OUTA)
NetR1_2_1: R1_2.1 U1_1.10(OUTB)
NetR1_5_2: R1_5.2 U1_1.5(EN)
NetR1_6_1: R1_6.1 U1_2.15(OUTA)
NetR1_7_1: R1_7.1 U1_2.10(OUTB)
NetR1_10_2: R1_10.2 U1_2.5(EN)
NetR2_1_1: R2_1.1 U2_2.3(HO)
NetR2_2_1: R2_2.1 U2_2.8(LO)
NetR2_3_1: R2_3.1 U2_3.3(HO)
NetR2_4_1: R2_4.1 U2_3.8(LO)
NetR2_9_1: R2_9.1 R2_10.2 R2_11.1
NetR2_9_2: R2_9.2 U2_1.7(Vout)
NetR3_8_2: R3_8.2 U3_2.2(+Vin(Vcc))
NetR3_9_1: R3_9.1 U3_3.2(+Vin(Vcc))
NetR4_1_2: R4_1.2 U4_1.Vc(13)
NetR4_2_2: R4_2.2 R4_3.2 U4_1.IREG/SS(14)
NetR4_5_1: R4_5.1 U4_1.DCM(10)
NetR4_7_1: R4_7.1 R4_8.2 R4_9.2 U4_1.FB(12)
NetR4_9_1: R4_9.1 U4_1.TC(11)
NetR4_11_2: R4_11.2 R4_12.1
NetR5_1_1: R5_1.1 R5_2.2
NetR5_2_1: R5_2.1 R5_3.2 R5_4.1
NetR6_1_1: R6_1.1 R6_2.2
NetR6_2_1: R6_2.1 R6_3.2
NetR6_3_1: R6_3.1 R6_4.2
NetR6_5_1: R6_5.1 R6_6.2
NetR7_1_1: R7_1.1 U7_1.2(1IN-)
NetR7_1_2: R7_1.2 R7_3.1 R7_4.1
NetR7_2_1: R7_2.1 U7_1.3(1IN+)
NetR7_5_1: R7_5.1 R7_6.2
NetR7_7_2: R7_7.2 U7_1.1(1OUT)
NetR7_8_1: R7_8.1 R7_9.2
NetR8_1_1: R8_1.1 R8_2.1 R8_3.1
NetR9_1_2: R9_1.2 U9_2.LE(11)
NetR10_2_1: R10_2.1 U10_1.2(1IN-)
NetR10_2_2: R10_2.2 R10_10.1 R10_11.2
NetR10_3_2: R10_3.2 RP10_1.2 U9_4.1(1A)
NetR10_4_2: R10_4.2 RP10_2.2 U9_4.4(2A)
NetR10_7_2: R10_7.2 U10_1.1(1OUT)
NetR10_8_1: R10_8.1 R10_9.2
NetR10_10_2: R10_10.2 R10_13.2
NetR11_2_1: R11_2.1 U11_1.3(1IN+)
NetR11_2_2: R11_2.2 R11_10.1 R11_11.2
NetR11_3_2: R11_3.2 RP11_1.2 U9_4.9(3A)
NetR11_4_2: R11_4.2 RP11_2.2 U9_4.12(4A)
NetR11_7_2: R11_7.2 U11_1.1(1OUT)
NetR11_8_1: R11_8.1 R11_9.2
NetR11_10_2: R11_10.2 R11_13.2
NetR13_1_1: R13_1.1 U13_1.2(1IN-)
NetR13_2_1: R13_2.1 R13_4.1 R13_5.2
NetR13_3_1: R13_3.1 R13_12.2
NetR13_6_2: R13_6.2 U13_1.1(1OUT)
NetR13_7_1: R13_7.1 R13_8.2
NetR13_11_1: R13_11.1 U13_2.1(1Y) U13_2.5(2A)
NetR13_11_2: R13_11.2 SC_ROG.2
NetU9_1_/Y: U9_1./Y(8) U9_2./OE(1)

Not connected (* = marked no-connect by the designer): L1 2; U1_1 6(DT) 7(NC) 12(NC) 13(NC); U1_2 6(DT) 7(NC) 12(NC) 13(NC); U2_1 4(OUT3); U3_1 4(NP) 6(On/Off); U3_2 4(NP) 6(NC) 7(NC); U3_3 4(NP) 6(NC) 7(NC); U3_4 8(NC); U3_5 8(NC); U4_1 NC5(19); U7_1 5(2IN+) 6(2IN-) 7(2OUT); U9_1 NC_1(9) NC_2(10) NC_3(13); U10_1 5(2IN+) 6(2IN-) 7(2OUT); U11_1 5(2IN+) 6(2IN-) 7(2OUT); U12_1 3 4 5 53 54 55 66; U13_1 5(2IN+) 6(2IN-) 7(2OUT); U13_2 8(3A) 9(3B) 10(3Y) 11(4A) 12(4B) 13(4Y)

### Notes on the sheet
- GLAVNA ŠEMA
- VN DRAJVERI
- NN DRAJVERI
- FLAJBEK
- NAPAJANJE
- ROGOVSKI ZAŠTITA
- Merenje napona baterije
- Merenje napona DC Bus-a
- (near J27) Merenje struje tenka sa VN strane
- Merenje struje tenka sa NN strane
- MERENJA
- SINHRONO ISPRAVLJANJE
- ZAŠTITNO NI KOLO I BUFFER
- DSP

### Library data of the parts
C1_1 = B32673P6474K000: 0.47uF 630VDC
C1_2-C1_4 = B32652A2332J000: 3.3n 2000VDC
C1_5 C1_10 C2_5 C2_6 C2_9 C2_10 = 08051A750JAT2A: CAP CER 3.3nF 50V; Capacitance: *; Tolerance: *; Insulated Resistance: *; Rated Voltage: *
C1_6-C1_9 C1_11-C1_14 C2_3 C2_7 = 08051A750JAT2A: CAP CER 1uF 50V; Capacitance: *; Tolerance: *; Insulated Resistance: *; Rated Voltage: *
C2_1 = B32523Q1475K000: 4.7uF 100VDC
C2_2 = AVX SM03 1A 105K AN 360
C2_4 C2_8 = 08051A750JAT2A: CAP CER 0.1uF 100V; Capacitance: *; Tolerance: *; Insulated Resistance: *; Rated Voltage: *
C2_11 C5_1 C6_1 C6_3 C6_4 C7_1 C10_1 C11_1 C13_2 = 08051A750JAT2A: CAP CER 0.1uF 100V X7R 0805; Capacitance: *; Tolerance: *; Insulated Resistance: *; Rated Voltage: *
C3_4 C3_5 = 12061C225K4Z2A: CAP 2.2uF MLCC SMD 100VDC
C3_6-C3_9 = 12061C225K4Z2A: CAP 4.7uF MLCC SMD 50VDC
C4_1 C4_2 = 12061C225K4Z2A: CAP 10uF MLCC SMD 50VDC
C4_3 = 08051A750JAT2A: CAP CER 22nF 100V X7R 0805; Capacitance: *; Tolerance: *; Insulated Resistance: *; Rated Voltage: *
C4_4 = C1206C681KGRACAUTO: CAP 0.33uF
C4_5 C4_8 = 08051A750JAT2A: CAP CER 47pF  0805; Capacitance: *; Tolerance: *; Insulated Resistance: *; Rated Voltage: *
C4_6 = C3225X7T2J104M160AC: CAP CER 0.1UF 630V X7T 1210; Capcitnce: *; Tolerance: *; Rated Voltage: *; Insulate Resistance: *
C4_7 = UPW2A151MHD: CAP ALUM 150UF 20% 100V RADIAL; Capcitnce: *; Tolerance: *; Rated Voltage: *; Insulate Resistance: *
C6_2 = 08051A750JAT2A: CAP CER 100pF 100V 0805; Capacitance: *; Tolerance: *; Insulated Resistance: *; Rated Voltage: *
C8_1 = 08051A750JAT2A: CAP CER 75PF 100V C0G/NP0 0805; Capacitance: *; Tolerance: *; Insulated Resistance: *; Rated Voltage: *
C13_1 = 08051A750JAT2A: CAP CER 3.3nF 50V C0G/NP0 0805; Capacitance: *; Tolerance: *; Insulated Resistance: *; Rated Voltage: *
CGND = 08051A750JAT2A: CAP CER ? 0805; Capacitance: *; Tolerance: *; Insulated Resistance: *; Rated Voltage: *
D2_1-D2_4 = 63CPQ100PBF: Manufacturer: Vishay; Rated current: 2x 30A; Datasheet: https://www.vishay.com/docs/94244/63cpq100.pdf; Distributor: https://www.digikey.com/product-detail/en/vishay-semiconductor-diodes-division/VS-20ETS08FPPBF/VS-20ETS08FPPBF-ND/2632091; Model: 63CPQ100PBF; Rated reverse voltage: 100V
D4_1 = CMMR1U-04: Diode Standard 400V 1A Surface Mount SOD-123F; Manufacturer: Central Semiconductor Corp; Manufacturer Part Number: CMMR1U-04 TR; Datasheet: https://www.digikey.com/product-detail/en/central-semiconductor-corp/CMMR1U-04-TR/CMMR1U-04-CT-ND/5325384; Package: SOD-123F
D4_5 = CMMR1U-08: Diode Standard 800V 1A Surface Mount SOD-123F; Manufacturer: Central Semiconductor Corp; Manufacturer Part Number: CMMR1U-08 TR; Datasheet: https://www.centralsemi.com/get_document.php?cmp=1&mergetype=pd&mergepath=pd&pdf_id=CMMR1U_SERIES.PDF; Package: SOD-123F
J5 J6 J25-J27 J30-J45 JA0-JA7 JG0-JG7 JG10 JG12-JG18 JG20 JG24-JG27 JG30 JG32 JG48 JG84 JG86 = Male_single_pin
L1_1 L2_1 = Ind_PCB3515M1: Manufacturer: *; Manufacturer Part Number: PCB3515M1; Value: *; Datasheet: *; Mounting Style: Through Hole; Package: *
L3_4 L3_5 = SDE0403A-100M: Fixed Inductors 10uH 20% SMD 0403 AEC-Q200
L3_6-L3_9 = Ind_RLB0914-470KL: FIXED IND 47UH 1.5A 140 MOHM TH 912-220KL; Manufacturer: Bourns Inc.; Detailed Description: 47µH Unshielded Wirewound Inductor 1.56A 140 mOhm Max Radial; Datasheet: http://www.bourns.com/docs/Product-Datasheets/rlb.pdf; Manufacturer Part Number: RLB0914-470KL
P6_1 = Header 2: Header, 2-Pin; LatestRevisionDate: 17-Jul-2002; LatestRevisionNote: Re-released for DXP Platform.; Publisher: Altium Limited
Q1_1-Q1_4 = SCT3030AL SMD: SiC 70A 650V
Q2_1-Q2_4 = IPB017N10N5ATMA1: pin to pad: D,8>8 G,1>1 S(2, 3, 5, 6, 7)>2+3+5+6+7; Manufacturer: Infineon; Model: IPB017N10N5ATMA1CT; Rated current: 180A; Datasheet: https://www.infineon.com/dgdl/Infineon-IPB017N10N5-DS-v02_03-EN.pdf?fileId=5546d4624a75e5f1014ac4a981111eed; Distributor: https://www.digikey.com/product-detail/en/infineon-technologies/IPB017N10N5ATMA1/IPB017N10N5ATMA1CT-ND/5213948; Price: 7.59$; Rated voltage: 100V
R1_1-R1_4 R1_6-R1_9 R2_5-R2_9 R2_11 R5_4 R6_7 R7_7 R10_7 R11_7 R13_3 R13_6 = R0805 100: Value: *
R1_5 R1_10 R7_8 R10_8 R10_10 R11_8 R11_11 R13_4 R13_5 R13_7 R13_9 R13_10 = R0805 11K: Value: *
R2_1-R2_4 = R0805 100: R0805 10; Value: *
R2_10 = R0805 100: R0805 1.2k; Value: *
R3_1-R3_9 R4_10 R10_12 R10_13 R11_12 R11_13 R13_12 = R0805 100: R0805 0; Value: *
R4_1 = R0805 110K: Value: *
R4_2 R4_3 = RC0805FR-0788K7L: RES SMD 120k 0805; Value: *
R4_4 = R0805 110K: R0805 0.267; Value: *
R4_5 = R0805 200K: R0805 20K
R4_6 = R0805 330: R0805 200; Value: *
R4_7 R4_11 R4_12 = RC0805FR-07324KL: RES SMD 324K OHM 1% 1/8W 080; Value: *
R4_8 = R0805 100: R0805 5.1k; Value: *
R4_9 = RC0805FR-07191KL: Thick Film Resistors - SMD 191K OHM 1%; Value: *
R5_1 R5_2 = R0805 100: R0805 10k; Value: *
R5_3 = R0805 11K: R0805 1.2k; Value: *
R6_1-R6_4 = ERA-3AEB154V: RES SMD 150K OHM 0.1% 1/10W 0603; Value: *
R6_5 R6_6 = ERA-6AEB122V: RES SMD 1.2K OHM 0.1% 1/8W 0805; Value: *
R7_1 R7_2 R7_10 R8_2 R10_2-R10_4 R11_2-R11_4 R13_1 R13_2 R13_11 = R0805 330: Value: *
R7_3 R8_1 = R0805 11K: R0805 10K; Value: *
R7_4 R8_3 = R0805 11K: R0805 10k; Value: *
R7_5 R7_6 R8_4 = R0805 330: R0805 10; Value: *
R7_9 R10_9 R11_9 R13_8 = R0805 11K: R0805 2.2k; Value: *
R9_1 R12_2 = R0805 330: R0805 2.2k; Value: *
R10_11 R11_10 = R0805 11K: R0805 16.2k; Value: *
R12_1 R12_3 = R0805 330: R0805 4.7k; Value: *
RGND = R0805 100: R0805 ?; Value: *
RP10_1 RP10_2 RP11_1 RP11_2 = R0805 11K: R0805 0; Value: *
SC_ROG = 0805SR-T1: LED RED 0805
U1_1 U1_2 = UCC21521: 4-A, 6-A, 5.7-kVRMS Isolated Dual-Channel Gate Driver with Enable
U2_1 = LEM LTS 25-NP: SENSOR CURRENT HALL 25A AC/DC; Datasheet: http://www.lem.com/docs/marketing/LEM%20Leaflet%20CAS%20CASR%20CKSR.pdf
U2_2 U2_3 = UCC27211AQ: IC DVR HIGH/LOW SIDE 4A 8SO; Manufacturer: Texas Instruments; Datasheet: https://www.digikey.com/product-detail/en/texas-instruments/UCC27211AQDDARQ1/296-43737-1-ND/5825160; Manufacturer Part Number: UCC27211AQDDARQ1; case: 8-PowerSOIC (0.154", 3.90mm Width)
U3_1 = THL 10-4812WI: DC/DC 12V 10W; Number of outputs: 1 output; Datasheet: https://eu.mouser.com/ProductDetail/TRACO-Power/THL-10-4812WI?qs=ckJk83FOD0XhNgzKsIjluA%3D%3D; Dimensions: 25.4 mm x 25.4 mm x 10.2 mm; Power: 10 W
U3_2 U3_3 = TRN 3-1211SM: DC/DC Isolated 12V IN 5V OUT; Input voltage: 9 V to 18 V; Datasheet: https://eu.mouser.com/ProductDetail/TRACO-Power/TRN-3-1211SM?qs=YCa%2FAAYMW007LJ18m41WwQ%3D%3D; Dimensions: Length: 11.9 mm   Width: 11.3 mm   Height: 8 mm; Package: SMD-7; Output voltage: 5 V
U3_4 U3_5 = R2S-1215: Isolated DC/DC Converters 2W DC/DC 1kV UNREG 12Vin 15Vout; Input: 12 V; Output: 15 V; Datasheet: https://eu.mouser.com/ProductDetail/RECOM-Power/R2S-1215/?qs=XF8hdbuHJAVw9PIFQRYGrQ%3D%3D; Power: 2 W; Dimensions: Length:12.75 mm   Width: 10.7 mm   Height: 9 mm
U3_6-U3_9 = R12P22005D: Isolated DC/DC Converters 2W 12Vin +20/-5Vout 50/-200mA; pin to pad: +Vin>1 +Vout>7 -Vin>2 -Vout>5 Com>6; Datasheet: https://eu.mouser.com/ProductDetail/RECOM-Power/R12P22005D?qs=IbBl3rwNelMC3ifgsyAt%2FQ%3D%3D; Mounting style: Throgh-hole; Package: SIP; Dimensions: 19.5 mm x 9.8 mm x 12.5 mm; Series: RxxP2xxxxD
U4_1 = LT8315: LT8315 Isolated Flyback Converter; pin to pad: BIAS>9 DCM>10 Drain1>1 Drain2>2 Drain3>3 EN/UVLO>17 FB>12 GND1>15 GND2>20 GND3>21 INTVcc>8 IREG/SS>14 NC5>21 SMode>16 Source>18 TC>11 Vc>13; Datasheet: http://www.analog.com/media/en/technical-documentation/data-sheets/8315fa.pdf
U6_1 = ACPL-C87B-000E: Optically Isolated Amplifiers Precision Iso-Amp; Manufacturer: Broadcom Limited; Manufacturer Part Number: ACPL-C87B-000E; Datasheet: http://www.mouser.com/ds/2/678/V02-3563EN_DS_ACPL-C87x_2016-09-05-909299.pdf; Mounting Style: SMD/SMT; Package: SSO-8
U7_1 U10_1 U11_1 U13_1 = LM293D: Dual Differential Comparator
U9_1 = TI CD74HC30M96: pin to pad: /Y>8 A>1 B>2 C>3 D>4 E>5 F>6 G>11 GND>7 H>12 NC_1>9 NC_2>10 NC_3>13 VCC>14
U9_2 = 74LCX373SJX: pin to pad: /OE>1 D0>3 D1>4 D2>7 D3>8 D4>13 D5>14 D6>17 D7>18 GND>10 LE>11 O0>2 O1>5 O2>6 O3>9 O4>12 O5>15 O6>16 O7>19 VCC>20
U12_1 = DSP 28335: DIMM100 5390213-1; Manufacturer: TE Connectivity AMP Connectors; Datasheet: https://www.digikey.com/product-detail/en/te-connectivity-amp-connectors/5390213-1/A121375-ND/2262250; Manufacturer Part Number: 5390213-1
L1_2 = P8202NLT: Ns: *; Np: *; Frequency range: *; Current Rating: *
L2_2 = PB0026NLT: Ns: *; Np: *; Frequency range: *; Current Rating: *
T1 = PCB5528WC: Manufacturer: *; Manufacturer Part Number: PCB5528WC; Value: *; Package: *; Datasheet: *; Mounting Style: Through Hole